# Altium project BME498_Capstone.PrjPcb
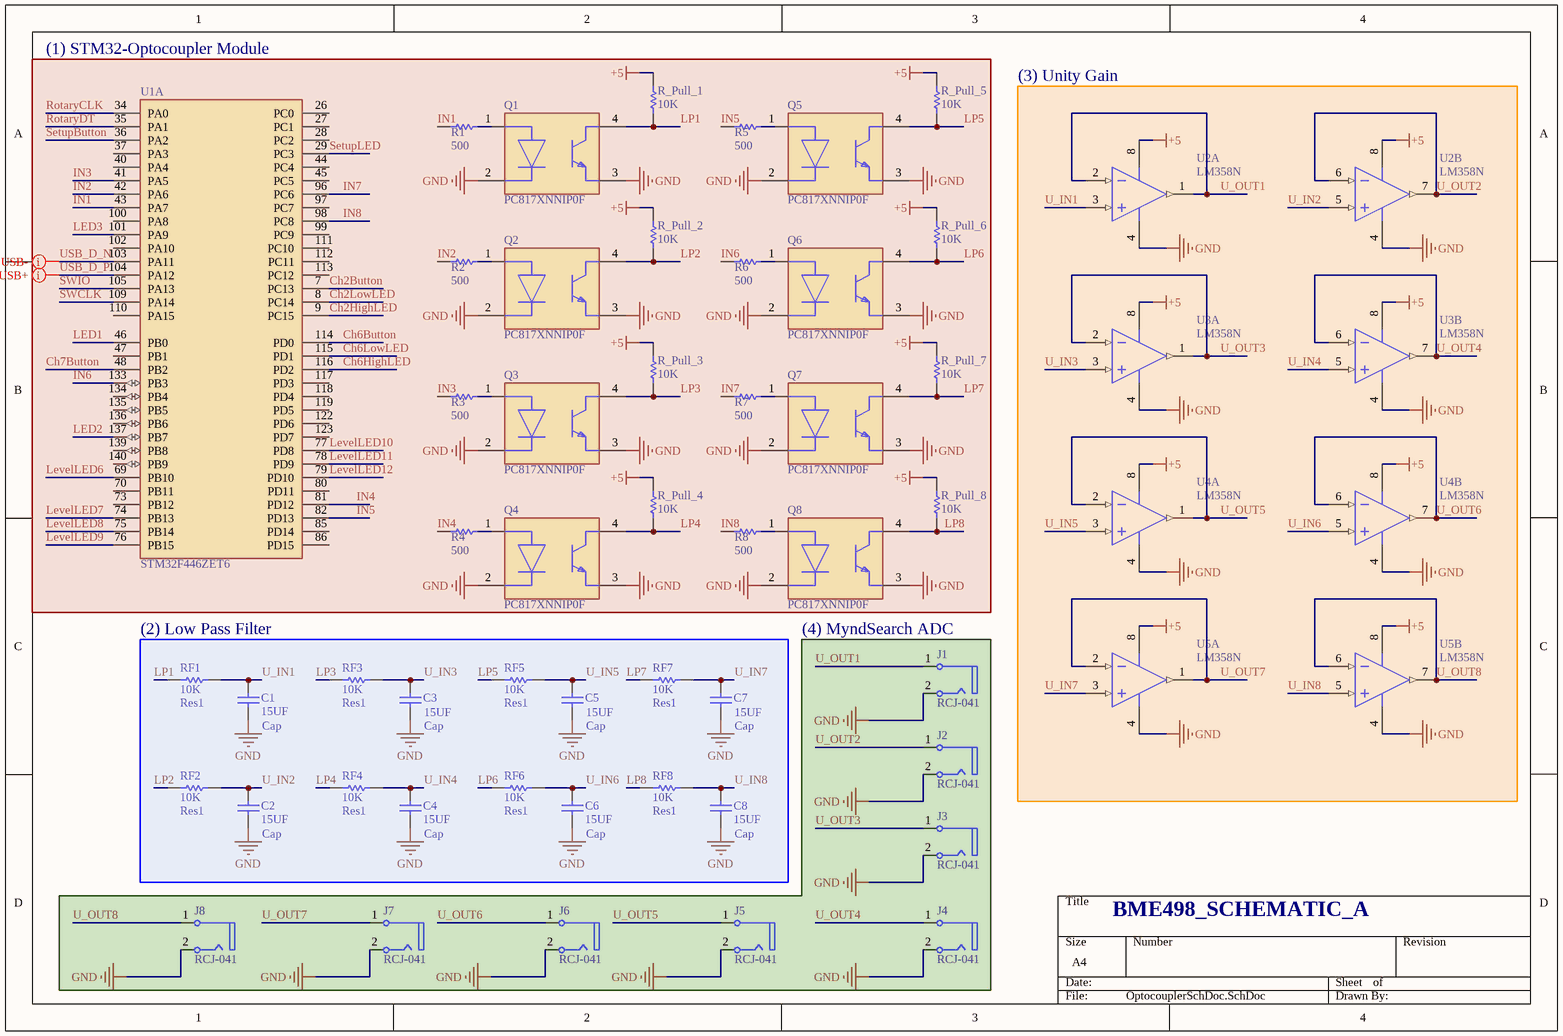
[diagram p0: OptocouplerSchDoc.SchDoc]
2 sheets, 173 parts. Net scope: global (net labels, ports and power ports of the same name join across sheets).
Board file: BME498_PCB.PcbDoc
Sheets:
  OptocouplerSchDoc.SchDoc
  STM32_Peripherals.SchDoc

## Sheet OptocouplerSchDoc.SchDoc
size A4; SheetNumber: 1; SheetTotal: 2

### Parts
C1  Cap  value 15UF  [RADIAL-0.1]
C2  Cap  value 15UF  [RADIAL-0.1]
C3  Cap  value 15UF  [RADIAL-0.1]
C4  Cap  value 15UF  [RADIAL-0.1]
C5  Cap  value 15UF  [RADIAL-0.1]
C6  Cap  value 15UF  [RADIAL-0.1]
C7  Cap  value 15UF  [RADIAL-0.1]
C8  Cap  value 15UF  [RADIAL-0.1]
J1  RCJ-041  [CUI-RCJ-041_V]
J2  RCJ-041  [CUI-RCJ-041_V]
J3  RCJ-041  [CUI-RCJ-041_V]
J4  RCJ-041  [CUI-RCJ-041_V]
J5  RCJ-041  [CUI-RCJ-041_V]
J6  RCJ-041  [CUI-RCJ-041_V]
J7  RCJ-041  [CUI-RCJ-041_V]
J8  RCJ-041  [CUI-RCJ-041_V]
Q1  PC817XNNIP0F  [FP-PC817XNNIP0F-MFG]
Q2  PC817XNNIP0F  [FP-PC817XNNIP0F-MFG]
Q3  PC817XNNIP0F  [FP-PC817XNNIP0F-MFG]
Q4  PC817XNNIP0F  [FP-PC817XNNIP0F-MFG]
Q5  PC817XNNIP0F  [FP-PC817XNNIP0F-MFG]
Q6  PC817XNNIP0F  [FP-PC817XNNIP0F-MFG]
Q7  PC817XNNIP0F  [FP-PC817XNNIP0F-MFG]
Q8  PC817XNNIP0F  [FP-PC817XNNIP0F-MFG]
R1  500  [RESC2013X60X35ML10T20]
R2  500  [RESC2013X60X35ML10T20]
R3  500  [RESC2013X60X35ML10T20]
R4  500  [RESC2013X60X35ML10T20]
R5  500  [RESC2013X60X35ML10T20]
R6  500  [RESC2013X60X35ML10T20]
R7  500  [RESC2013X60X35ML10T20]
R8  500  [RESC2013X60X35ML10T20]
R_Pull_1  10K  [RESC2013X60X35ML10T20]
R_Pull_2  10K  [RESC2013X60X35ML10T20]
R_Pull_3  10K  [RESC2013X60X35ML10T20]
R_Pull_4  10K  [RESC2013X60X35ML10T20]
R_Pull_5  10K  [RESC2013X60X35ML10T20]
R_Pull_6  10K  [RESC2013X60X35ML10T20]
R_Pull_7  10K  [RESC2013X60X35ML10T20]
R_Pull_8  10K  [RESC2013X60X35ML10T20]
RF1  Res1  value 10K  [AXIAL-0.3]
RF2  Res1  value 10K  [AXIAL-0.3]
RF3  Res1  value 10K  [AXIAL-0.3]
RF4  Res1  value 10K  [AXIAL-0.3]
RF5  Res1  value 10K  [AXIAL-0.3]
RF6  Res1  value 10K  [AXIAL-0.3]
RF7  Res1  value 10K  [AXIAL-0.3]
RF8  Res1  value 10K  [AXIAL-0.3]
U1  STM32F446ZET6  [FP-STM32F446ZET6-MFG]  (part A of 3)
U2  LM358N  [ONSC-PDIP-8-626-05_M]  (parts A,B of 2)
U3  LM358N  [ONSC-PDIP-8-626-05_M]  (parts A,B of 2)
U4  LM358N  [ONSC-PDIP-8-626-05_M]  (parts A,B of 2)
U5  LM358N  [ONSC-PDIP-8-626-05_M]  (parts A,B of 2)

### Blocks framed on the sheet
(1) STM32-Optocoupler Module: Q1-Q8 R1-R8 R_Pull_1-R_Pull_8 U1
(3) Unity Gain: U2-U5
(2) Low Pass Filter: C1-C8 RF1-RF8

### Nets
+5: R_Pull_1.2 R_Pull_2.2 R_Pull_3.2 R_Pull_4.2 R_Pull_5.2 R_Pull_6.2 R_Pull_7.2 R_Pull_8.2 U2.8(VCC) U3.8(VCC) U4.8(VCC) U5.8(VCC)
GND: C1.1 C2.1 C3.1 C4.1 C5.1 C6.1 C7.1 C8.1 J1.2 J2.2 J3.2 J4.2 J5.2 J6.2 J7.2 J8.2 Q1.2(C) Q1.3(E) Q2.2(C) Q2.3(E) Q3.2(C) Q3.3(E) Q4.2(C) Q4.3(E) Q5.2(C) Q5.3(E) Q6.2(C) Q6.3(E) Q7.2(C) Q7.3(E) Q8.2(C) Q8.3(E) U2.4(VEE/GND) U3.4(VEE/GND) U4.4(VEE/GND) U5.4(VEE/GND)
Ch2Button: U1.7(PC13)
Ch2HighLED: U1.9(PC15)
Ch2LowLED: U1.8(PC14)
Ch6Button: U1.114(PD0)
Ch6HighLED: U1.116(PD2)
Ch6LowLED: U1.115(PD1)
Ch7Button: U1.48(PB2)
IN1: R1.1 U1.43(PA7)
IN2: R2.1 U1.42(PA6)
IN3: R3.1 U1.41(PA5)
IN4: R4.1 U1.81(PD12)
IN5: R5.1 U1.82(PD13)
IN6: R6.1 U1.133(PB3)
IN7: R7.1 U1.96(PC6)
IN8: R8.1 U1.98(PC8)
LED1: U1.46(PB0)
LED2: U1.137(PB7)
LED3: U1.101(PA9)
LevelLED6: U1.69(PB10)
LevelLED7: U1.74(PB13)
LevelLED8: U1.75(PB14)
LevelLED9: U1.76(PB15)
LevelLED10: U1.77(PD8)
LevelLED11: U1.78(PD9)
LevelLED12: U1.79(PD10)
LP1: Q1.4(C) R_Pull_1.1 RF1.1
LP2: Q2.4(C) R_Pull_2.1 RF2.1
LP3: Q3.4(C) R_Pull_3.1 RF3.1
LP4: Q4.4(C) R_Pull_4.1 RF4.1
LP5: Q5.4(C) R_Pull_5.1 RF5.1
LP6: Q6.4(C) R_Pull_6.1 RF6.1
LP7: Q7.4(C) R_Pull_7.1 RF7.1
LP8: Q8.4(C) R_Pull_8.1 RF8.1
RotaryCLK: U1.34(PA0)
RotaryDT: U1.35(PA1)
SetupButton: U1.36(PA2)
SetupLED: U1.29(PC3)
SWCLK: U1.109(PA14)
SWIO: U1.105(PA13)
U_IN1: C1.2 RF1.2 U2.3(INA+)
U_IN2: C2.2 RF2.2 U2.5(INB+)
U_IN3: C3.2 RF3.2 U3.3(INA+)
U_IN4: C4.2 RF4.2 U3.5(INB+)
U_IN5: C5.2 RF5.2 U4.3(INA+)
U_IN6: C6.2 RF6.2 U4.5(INB+)
U_IN7: C7.2 RF7.2 U5.3(INA+)
U_IN8: C8.2 RF8.2 U5.5(INB+)
U_OUT1: J1.1 U2.1(OUTA) U2.2(INA-)
U_OUT2: J2.1 U2.6(INB-) U2.7(OUTB)
U_OUT3: J3.1 U3.1(OUTA) U3.2(INA-)
U_OUT4: J4.1 U3.6(INB-) U3.7(OUTB)
U_OUT5: J5.1 U4.1(OUTA) U4.2(INA-)
U_OUT6: J6.1 U4.6(INB-) U4.7(OUTB)
U_OUT7: J7.1 U5.1(OUTA) U5.2(INA-)
U_OUT8: J8.1 U5.6(INB-) U5.7(OUTB)
USB_D_N: U1.103(PA11)
USB_D_P: U1.104(PA12)
NetQ1_1: Q1.1(A) R1.2
NetQ2_1: Q2.1(A) R2.2
NetQ3_1: Q3.1(A) R3.2
NetQ4_1: Q4.1(A) R4.2
NetQ5_1: Q5.1(A) R5.2
NetQ6_1: Q6.1(A) R6.2
NetQ7_1: Q7.1(A) R7.2
NetQ8_1: Q8.1(A) R8.2

Not connected (* = marked no-connect by the designer): U1 26(PC0) 27(PC1) 28(PC2) 37(PA3) 40(PA4) 44(PC4) 45(PC5) 47(PB1) 70(PB11) 73(PB12) 80(PD11) 85(PD14) 86(PD15) 97(PC7) 99(PC9) 100(PA8) 102(PA10) 110(PA15) 111(PC10) 112(PC11) 113(PC12) 117(PD3) 118(PD4) 119(PD5) 122(PD6) 123(PD7) 134(PB4) 135(PB5) 136(PB6) 139(PB8) 140(PB9)

### Layout directives
differential pair: USB_D_N, USB_D_P

### Notes on the sheet
- (4) MyndSearch ADC
- BME498_SCHEMATIC_A

### Library data of the parts
C1-C8 = CAP ALUM 15UF 20% 16V RADIAL: Capacitor; Manufacturer Part Number: EEA-GA1C150B; Voltage Rating: 16V; Published: 8-Jun-2000; LatestRevisionDate: 17-Jul-2002; LatestRevisionNote: Re-released for DXP Platform.; Publisher: Altium Limited
J1-J8 = CMP-1692-00002-1: Female RCJ Jack, 2 Position, Height 11.724 mm, Tail Length 4 mm, RoHS, Bulk; Case\Package: Metal; Connector Type: HDMI; Current Rating: 500 mA; Voltage Rating: 40 V; Length: 16.2 mm; Pins: 19; ComponentLink1URL: http://www.cui.com/; ComponentLink1Description: Manufacturer URL; Packaging: Tape and Reel; Lead Pitch: 0.5 mm; PackageDescription: Female RCJ Jack, 2 Position, Height 11.724 mm, Tail Length 4 mm; RoHSCompliant: true; Min Operating Temperature: -55 degC; Height: 6.1 mm; Contact Material: Copper; REACH SVHC: No SVHC; DatasheetVersion: Rev. B, 02/2012; ComponentLink2Description: Datasheet; Contact Plating: Gold; Colour: Black; Max Operating Temperature: 85 degC; Mount: Surface Mount; Package Quantity: 400; Gender: Female; ComponentLink2URL: http://www.cui.com/product/resource/rcj-04x.pdf; PackageReference: RCJ-041
Q1-Q8 = CMP-65434-000005-1: OPTOISOLATOR 5KV TRANS 4SMD; Reverse Breakdown Voltage: 6V; Output Current per Channel: 30mA; Power Dissipation: 200mW; Collector-emitter Voltage-Max: 200mV; Max Output Voltage: 80V; Input Current: 50mA; Forward Voltage: 1.4V; Fall Time: 18000ns; Number of Elements: 1; Input Type: DC; Packaging: Tape and Reel; RoHS Compliant: Yes; Contact Plating: Copper; Min Operating Temperature: -30°C; Collector Emitter Saturation Voltage: 200mV; Max Input Current: 50mA; Radiation Hardening: No; Max Collector Current: 50mA; Case/Package: SMD/SMT; Mount: Surface Mount; Output Voltage: 80V; Forward Current: 50mA; Max Power Dissipation: 200mW; Collector Emitter Voltage (VCEO): 80V; Number of Channels: 1; Rise Time: 18000ns; Isolation Voltage: 5kV; Number of Pins: 4; Lead Free: Lead Free; Package Quantity: 2000; Isolation Voltage-Max: 5kV; Max Operating Temperature: 100°C
R1-R8 = CMP-2100-03671-1: Chip Resistor, 1 KOhm, +/- 1%, 125 mW, -55 to 155 degC, 0805 (2012 Metric), RoHS, Tape and Reel; Manufacturer: Yageo; Temperature Coefficient: 100ppm/degreesC; Voltage Rating (DC): 150V; Max Power Dissipation: 125mW; Resistance: 500Ohm; Number of Pins: 2; Number of Terminations: 2; Datasheet URL: http://www.yageo.com/NewPortal/yageodocoutput?fileName=/pdf/R-Chip/PYu-RC_Group_51_RoHS_L_5.pdf; Length: 0.079inch; Package Description: 2-Pin Surface Mounted Device, Body 2 x 1.25 mm; Depth: 1.25mm; Height: 0.024inch; Military Standard: Not; Case/Package: 0805; Package Reference: 0805; RoHSCompliant: true; Lead Free: LeadFree; Packaging: TapeandReel; Package Quantity: 1; Datasheet Version: Rev. 5, 10/2016; Tolerance: 1%; Min Operating Temperature: -55degC; Voltage Rating: 150V; Composition: ThickFilm; Case Code (Imperial): 0805; Power Rating: 125mW; Width: 0.049inch; Case Code (Metric): 2012; Manufacturer URL: http://www.yageo.com/; Max Operating Temperature: 155degC; REACH SVHC: Unknown; Termination: SMD/SMT
R_Pull_1-R_Pull_8 = CMP-2100-03671-1: Chip Resistor, 1 KOhm, +/- 1%, 125 mW, -55 to 155 degC, 0805 (2012 Metric), RoHS, Tape and Reel; Manufacturer: Yageo; Temperature Coefficient: 100ppm/degreesC; Voltage Rating (DC): 150V; Max Power Dissipation: 125mW; Resistance: 10KOhm; Number of Pins: 2; Number of Terminations: 2; Datasheet URL: http://www.yageo.com/NewPortal/yageodocoutput?fileName=/pdf/R-Chip/PYu-RC_Group_51_RoHS_L_5.pdf; Length: 0.079inch; Package Description: 2-Pin Surface Mounted Device, Body 2 x 1.25 mm; Depth: 1.25mm; Height: 0.024inch; Military Standard: Not; Case/Package: 0805; Package Reference: 0805; RoHSCompliant: true; Lead Free: LeadFree; Packaging: TapeandReel; Package Quantity: 1; Datasheet Version: Rev. 5, 10/2016; Tolerance: 1%; Min Operating Temperature: -55degC; Voltage Rating: 150V; Composition: ThickFilm; Case Code (Imperial): 0805; Power Rating: 125mW; Width: 0.049inch; Case Code (Metric): 2012; Manufacturer URL: http://www.yageo.com/; Max Operating Temperature: 155degC; REACH SVHC: Unknown; Termination: SMD/SMT
RF1-RF8 = RES 10K OHM 5% 1/4W AXIAL: Resistor; Manufacturer Part Number: CFR-25JB-52-10K; Designator: R?; Power Rating: 1/4W; Tolerance: 0.05; Published: 8-Jun-2000; LatestRevisionDate: 17-Jul-2002; LatestRevisionNote: Re-released for DXP Platform.; Publisher: Altium Limited
U1 = CMP-12105-000067-1: IC MCU 32BIT 512KB FLASH 144LQFP; Manufacturer: STMicroelectronics; Standoff Height: 0.05mm; Memory Size: 512KBytes; Data Bus Width: 32bits; Number Of Timers/Counters: 14; Number Of I2C Channels: 4; Number Of Usb Channels: 2; Frequency: 180MHz; Ram Size: 128KBytes; Number Of I/Os: 114; Min Supply Voltage: 1.7V; Max Junction Temp: +105°C; Number Of Cores: 1; Core Architecture: Arm Cortex-M4; Max Supply Voltage: 3.6V; Number Of Adc Channels: 24; Number Of Pwm Channels: 32; Number Of Uart Channels: 6; Number Of A/D Converters: 3; Interface: I2C,SPI,UART,USART,EBI/EMI,CAN,USB,LIN,IrDA,I2S,SMBus,Other; Mouser Description: 32 Bit Microcontroller, High Performance, Arm Cortex-M4, 180 Mhz, 512 Kb, 128 Kb, 144, Lqfp; Temperature Range High: +105°C; Device Class L3: Microcontrollers; Ambient Temperature Range High: +85°C; Lead Free: Yes; Octopart: https://octopart.com/stm32f446zet6-stmicroelectronics-52642927; Device Class L2: Embedded Processors and Controllers; Height: 1.6mm; Category: IC; Manufacturer Part Number: STM32F446ZET6; RoHS: TRUE; Memory Type: FLASH; Temperature: -40°C to +105°C; Number Of Spi Channels: 4; Device Class L1: Integrated Circuits (ICs); Package: LQFP144; Digikey Description: IC MCU 32BIT 512KB FLASH 144LQFP; Automotive: No; ComponentLink2Description: Datasheet; ComponentLink2URL: https://www.st.com/content/ccc/resource/technical/document/datasheet/65/cb/75/50/53/d6/48/24/DM00141306.pdf/files/DM00141306.pdf/jcr:content/translations/en.DM00141306.pdf; Ambient Temperature Range Low: -40°C; Temperature Range Low: -40°C
U2-U5 = CMP-1310-00098-1: Single Supply Dual Operational Amplifier, 3 to 32 V, 0 to 70 degC, 8-Pin PDIP, Tube; Manufacturer: On Semiconductor; VCC Max (V): 32; VCC Min (V): 3; Mounting Technology: Through Hole; ComponentLink3Description: Package Specification; ComponentLink3URL: http://www.onsemi.com/pub_link/Collateral/LM211-D.PDF; RoHS: FALSE; Packing: Tube; PackageDescription: 8-Pin Plastic Dual-In Line Package, Body 9.52 x 6.605 mm, Pitch 2.54 mm; PackageReference: PDIP-8-626-05; PackageVersion: Rev. M, 04/2010; PartNumber: LM358N; ComponentLink2Description: Datasheet; ComponentLink2URL: http://www.onsemi.cn/pub_link/Collateral/LM358-D.PDF; ComponentLink1URL: http://www.onsemi.com/; ComponentLink1Description: Manufacturer URL; DatasheetVersion: Rev. 27

## Sheet STM32_Peripherals.SchDoc
size A3; SheetNumber: 2; SheetTotal: 2
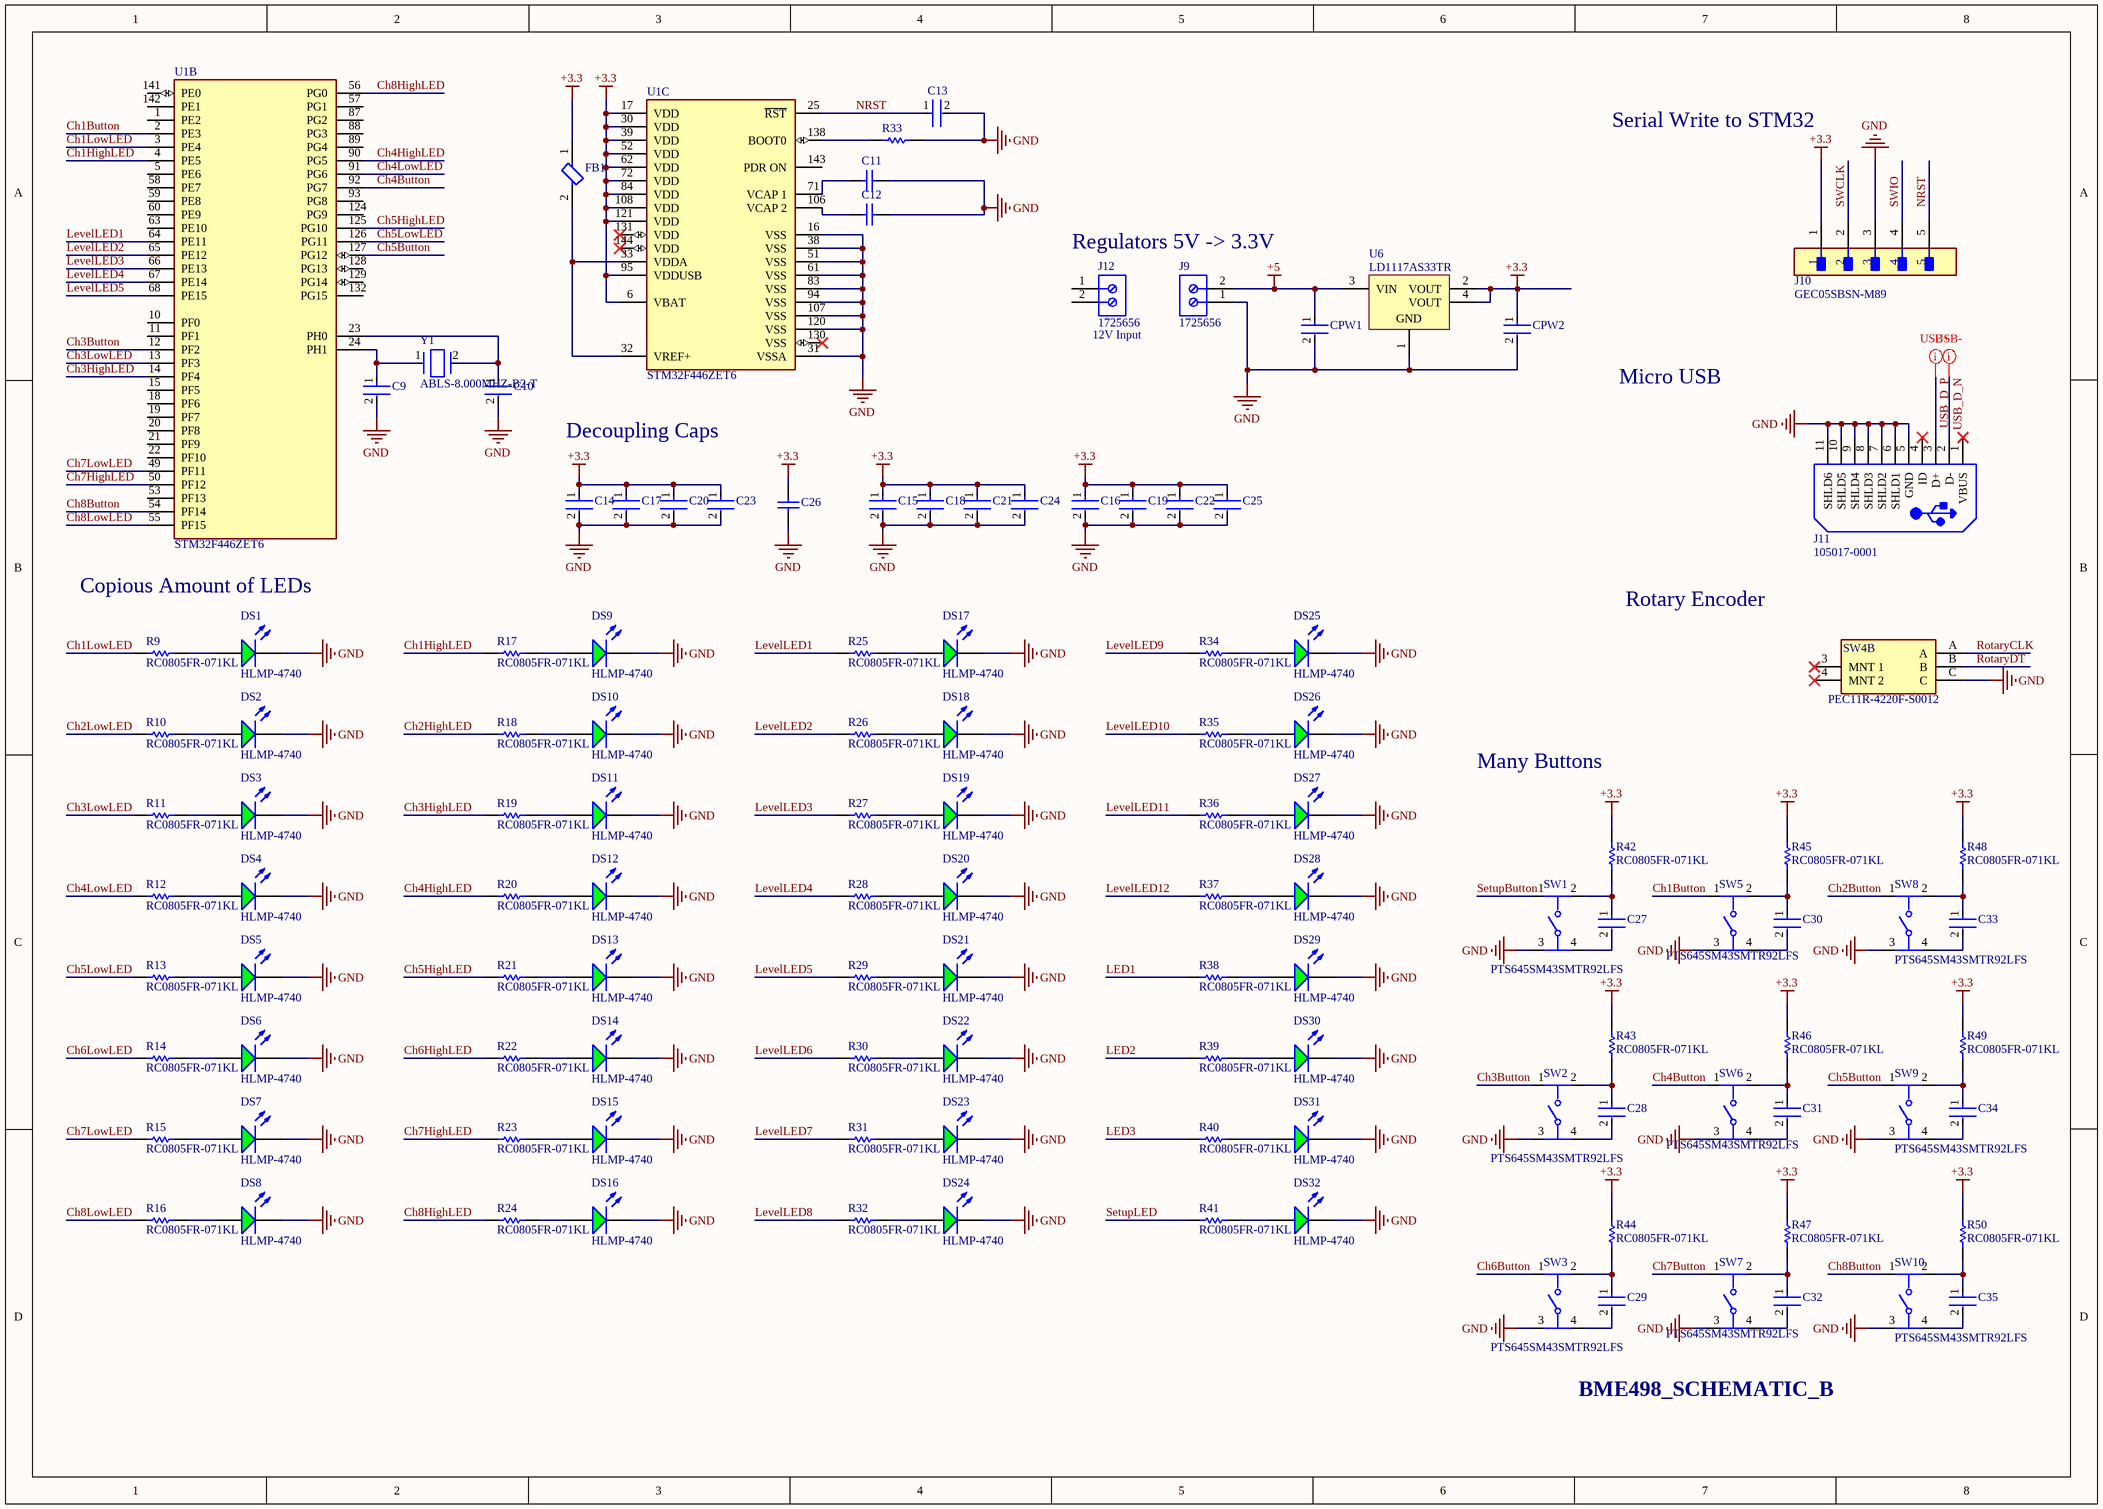
[diagram p1: STM32_Peripherals.SchDoc]

### Parts
C9  C0805C439C5GACTU  [FP-C0805C-DN-MFG]  (value not drawn)
C10  C0805C439C5GACTU  [FP-C0805C-DN-MFG]  (value not drawn)
C11  GRM21BR71C225KA12L  [CAPC2013X135X50ML10T20]  (value not drawn)
C12  GRM21BR71C225KA12L  [CAPC2013X135X50ML10T20]  (value not drawn)
C13  CC0805KRX7R9BB104  [FP-CC0805-0_85-MFG]  (value not drawn)
C14  CC0805KRX7R9BB104  [FP-CC0805-0_85-MFG]  (value not drawn)
C15  CC0805KRX7R9BB104  [FP-CC0805-0_85-MFG]  (value not drawn)
C16  CC0805KRX7R9BB104  [FP-CC0805-0_85-MFG]  (value not drawn)
C17  CC0805KRX7R9BB104  [FP-CC0805-0_85-MFG]  (value not drawn)
C18  CC0805KRX7R9BB104  [FP-CC0805-0_85-MFG]  (value not drawn)
C19  CC0805KRX7R9BB104  [FP-CC0805-0_85-MFG]  (value not drawn)
C20  CC0805KRX7R9BB104  [FP-CC0805-0_85-MFG]  (value not drawn)
C21  CC0805KRX7R9BB104  [FP-CC0805-0_85-MFG]  (value not drawn)
C22  CC0805KRX7R9BB104  [FP-CC0805-0_85-MFG]  (value not drawn)
C23  CC0805KRX7R9BB104  [FP-CC0805-0_85-MFG]  (value not drawn)
C24  CC0805KRX7R9BB104  [FP-CC0805-0_85-MFG]  (value not drawn)
C25  CC0805KRX7R9BB104  [FP-CC0805-0_85-MFG]  (value not drawn)
C26  GRM21BR61C475KA88L  [CAPC2013X135X45LL10T25]  (value not drawn)
C27  CC0805KRX7R9BB104  [FP-CC0805-0_85-MFG]  (value not drawn)
C28  CC0805KRX7R9BB104  [FP-CC0805-0_85-MFG]  (value not drawn)
C29  CC0805KRX7R9BB104  [FP-CC0805-0_85-MFG]  (value not drawn)
C30  CC0805KRX7R9BB104  [FP-CC0805-0_85-MFG]  (value not drawn)
C31  CC0805KRX7R9BB104  [FP-CC0805-0_85-MFG]  (value not drawn)
C32  CC0805KRX7R9BB104  [FP-CC0805-0_85-MFG]  (value not drawn)
C33  CC0805KRX7R9BB104  [FP-CC0805-0_85-MFG]  (value not drawn)
C34  CC0805KRX7R9BB104  [FP-CC0805-0_85-MFG]  (value not drawn)
C35  CC0805KRX7R9BB104  [FP-CC0805-0_85-MFG]  (value not drawn)
CPW1  CC0805KRX7R9BB104  [FP-CC0805-0_85-MFG]  (value not drawn)
CPW2  CC0805KRX7R9BB104  [FP-CC0805-0_85-MFG]  (value not drawn)
DS1  HLMP-4740  [AVAG-HLMP-4740]
DS2  HLMP-4740  [AVAG-HLMP-4740]
DS3  HLMP-4740  [AVAG-HLMP-4740]
DS4  HLMP-4740  [AVAG-HLMP-4740]
DS5  HLMP-4740  [AVAG-HLMP-4740]
DS6  HLMP-4740  [AVAG-HLMP-4740]
DS7  HLMP-4740  [AVAG-HLMP-4740]
DS8  HLMP-4740  [AVAG-HLMP-4740]
DS9  HLMP-4740  [AVAG-HLMP-4740]
DS10  HLMP-4740  [AVAG-HLMP-4740]
DS11  HLMP-4740  [AVAG-HLMP-4740]
DS12  HLMP-4740  [AVAG-HLMP-4740]
DS13  HLMP-4740  [AVAG-HLMP-4740]
DS14  HLMP-4740  [AVAG-HLMP-4740]
DS15  HLMP-4740  [AVAG-HLMP-4740]
DS16  HLMP-4740  [AVAG-HLMP-4740]
DS17  HLMP-4740  [AVAG-HLMP-4740]
DS18  HLMP-4740  [AVAG-HLMP-4740]
DS19  HLMP-4740  [AVAG-HLMP-4740]
DS20  HLMP-4740  [AVAG-HLMP-4740]
DS21  HLMP-4740  [AVAG-HLMP-4740]
DS22  HLMP-4740  [AVAG-HLMP-4740]
DS23  HLMP-4740  [AVAG-HLMP-4740]
DS24  HLMP-4740  [AVAG-HLMP-4740]
DS25  HLMP-4740  [AVAG-HLMP-4740]
DS26  HLMP-4740  [AVAG-HLMP-4740]
DS27  HLMP-4740  [AVAG-HLMP-4740]
DS28  HLMP-4740  [AVAG-HLMP-4740]
DS29  HLMP-4740  [AVAG-HLMP-4740]
DS30  HLMP-4740  [AVAG-HLMP-4740]
DS31  HLMP-4740  [AVAG-HLMP-4740]
DS32  HLMP-4740  [AVAG-HLMP-4740]
FB1  BLM21SP181SN1D  [FP-BLM21-0_2-t0_85-e0_5-IPC_A]  (value not drawn)
J9  1725656  [PHOE-1725656-2]
J10  GEC05SBSN-M89  [FP-GEC05SBSN-M89-MFG]
J11  105017-0001  [USB-MICRO-B_V]
J12  1725656  [PHOE-1725656-2]
R9  RC0805FR-071KL  [RESC2013X60X35ML10T20]
R10  RC0805FR-071KL  [RESC2013X60X35ML10T20]
R11  RC0805FR-071KL  [RESC2013X60X35ML10T20]
R12  RC0805FR-071KL  [RESC2013X60X35ML10T20]
R13  RC0805FR-071KL  [RESC2013X60X35ML10T20]
R14  RC0805FR-071KL  [RESC2013X60X35ML10T20]
R15  RC0805FR-071KL  [RESC2013X60X35ML10T20]
R16  RC0805FR-071KL  [RESC2013X60X35ML10T20]
R17  RC0805FR-071KL  [RESC2013X60X35ML10T20]
R18  RC0805FR-071KL  [RESC2013X60X35ML10T20]
R19  RC0805FR-071KL  [RESC2013X60X35ML10T20]
R20  RC0805FR-071KL  [RESC2013X60X35ML10T20]
R21  RC0805FR-071KL  [RESC2013X60X35ML10T20]
R22  RC0805FR-071KL  [RESC2013X60X35ML10T20]
R23  RC0805FR-071KL  [RESC2013X60X35ML10T20]
R24  RC0805FR-071KL  [RESC2013X60X35ML10T20]
R25  RC0805FR-071KL  [RESC2013X60X35ML10T20]
R26  RC0805FR-071KL  [RESC2013X60X35ML10T20]
R27  RC0805FR-071KL  [RESC2013X60X35ML10T20]
R28  RC0805FR-071KL  [RESC2013X60X35ML10T20]
R29  RC0805FR-071KL  [RESC2013X60X35ML10T20]
R30  RC0805FR-071KL  [RESC2013X60X35ML10T20]
R31  RC0805FR-071KL  [RESC2013X60X35ML10T20]
R32  RC0805FR-071KL  [RESC2013X60X35ML10T20]
R33  RC0805FR-0710KL  [RESC2013X60X35NL10T20]  (value not drawn)
R34  RC0805FR-071KL  [RESC2013X60X35ML10T20]
R35  RC0805FR-071KL  [RESC2013X60X35ML10T20]
R36  RC0805FR-071KL  [RESC2013X60X35ML10T20]
R37  RC0805FR-071KL  [RESC2013X60X35ML10T20]
R38  RC0805FR-071KL  [RESC2013X60X35ML10T20]
R39  RC0805FR-071KL  [RESC2013X60X35ML10T20]
R40  RC0805FR-071KL  [RESC2013X60X35ML10T20]
R41  RC0805FR-071KL  [RESC2013X60X35ML10T20]
R42  RC0805FR-071KL  [RESC2013X60X35ML10T20]
R43  RC0805FR-071KL  [RESC2013X60X35ML10T20]
R44  RC0805FR-071KL  [RESC2013X60X35ML10T20]
R45  RC0805FR-071KL  [RESC2013X60X35ML10T20]
R46  RC0805FR-071KL  [RESC2013X60X35ML10T20]
R47  RC0805FR-071KL  [RESC2013X60X35ML10T20]
R48  RC0805FR-071KL  [RESC2013X60X35ML10T20]
R49  RC0805FR-071KL  [RESC2013X60X35ML10T20]
R50  RC0805FR-071KL  [RESC2013X60X35ML10T20]
SW1  PTS645SM43SMTR92LFS  [FP-PTS645SM43SMTR92LFS-MFG]
SW2  PTS645SM43SMTR92LFS  [FP-PTS645SM43SMTR92LFS-MFG]
SW3  PTS645SM43SMTR92LFS  [FP-PTS645SM43SMTR92LFS-MFG]
SW4  PEC11R-4220F-S0012  [FP-PEC11R-4220F-S0012-MFG]  (part B of 2)
SW5  PTS645SM43SMTR92LFS  [FP-PTS645SM43SMTR92LFS-MFG]
SW6  PTS645SM43SMTR92LFS  [FP-PTS645SM43SMTR92LFS-MFG]
SW7  PTS645SM43SMTR92LFS  [FP-PTS645SM43SMTR92LFS-MFG]
SW8  PTS645SM43SMTR92LFS  [FP-PTS645SM43SMTR92LFS-MFG]
SW9  PTS645SM43SMTR92LFS  [FP-PTS645SM43SMTR92LFS-MFG]
SW10  PTS645SM43SMTR92LFS  [FP-PTS645SM43SMTR92LFS-MFG]
U1  STM32F446ZET6  [FP-STM32F446ZET6-MFG]  (parts B,C of 3)
U6  LD1117AS33TR  [SOT-223_M]
Y1  ABLS-8.000MHZ-B2-T  [FP-ABLS-MFG]

### Nets
+3.3: C14.1 C15.1 C16.1 C17.1 C18.1 C19.1 C20.1 C21.1 C22.1 C23.1 C24.1 C25.1 C26.1 CPW2.1 FB1.1 J10.1 R42.2 R43.2 R44.2 R45.2 R46.2 R47.2 R48.2 R49.2 R50.2 U1.6(VBAT) U1.17(VDD) U1.30(VDD) U1.39(VDD) U1.52(VDD) U1.62(VDD) U1.72(VDD) U1.84(VDD) U1.95(VDDUSB) U1.108(VDD) U1.121(VDD) U6.2(VOUT) U6.4(VOUT)
+5: CPW1.1 J9.2 U6.3(VIN)
GND: C9.2 C10.2 C11.2 C12.2 C13.2 C14.2 C15.2 C16.2 C17.2 C18.2 C19.2 C20.2 C21.2 C22.2 C23.2 C24.2 C25.2 C26.2 CPW1.2 CPW2.2 DS1.2(K) DS2.2(K) DS3.2(K) DS4.2(K) DS5.2(K) DS6.2(K) DS7.2(K) DS8.2(K) DS9.2(K) DS10.2(K) DS11.2(K) DS12.2(K) DS13.2(K) DS14.2(K) DS15.2(K) DS16.2(K) DS17.2(K) DS18.2(K) DS19.2(K) DS20.2(K) DS21.2(K) DS22.2(K) DS23.2(K) DS24.2(K) DS25.2(K) DS26.2(K) DS27.2(K) DS28.2(K) DS29.2(K) DS30.2(K) DS31.2(K) DS32.2(K) J9.1 J10.3 J11.5(GND) J11.6(SHLD1) J11.7(SHLD2) J11.8(SHLD3) J11.9(SHLD4) J11.10(SHLD5) J11.11(SHLD6) R33.2 SW1.3 SW2.3 SW3.3 SW4.C SW5.3 SW6.3 SW7.3 SW8.3 SW9.3 SW10.3 U1.16(VSS) U1.31(VSSA) U1.38(VSS) U1.51(VSS) U1.61(VSS) U1.83(VSS) U1.94(VSS) U1.107(VSS) U1.120(VSS) U6.1(GND)
Ch1Button: SW5.1 U1.2(PE3)
Ch1HighLED: R17.1 U1.4(PE5)
Ch1LowLED: R9.1 U1.3(PE4)
Ch2Button: SW8.1
Ch2HighLED: R18.1
Ch2LowLED: R10.1
Ch3Button: SW2.1 U1.12(PF2)
Ch3HighLED: R19.1 U1.14(PF4)
Ch3LowLED: R11.1 U1.13(PF3)
Ch4Button: SW6.1 U1.92(PG7)
Ch4HighLED: R20.1 U1.90(PG5)
Ch4LowLED: R12.1 U1.91(PG6)
Ch5Button: SW9.1 U1.127(PG12)
Ch5HighLED: R21.1 U1.125(PG10)
Ch5LowLED: R13.1 U1.126(PG11)
Ch6Button: SW3.1
Ch6HighLED: R22.1
Ch6LowLED: R14.1
Ch7Button: SW7.1
Ch7HighLED: R23.1 U1.50(PF12)
Ch7LowLED: R15.1 U1.49(PF11)
Ch8Button: SW10.1 U1.54(PF14)
Ch8HighLED: R24.1 U1.56(PG0)
Ch8LowLED: R16.1 U1.55(PF15)
LED1: R38.1
LED2: R39.1
LED3: R40.1
LevelLED1: R25.1 U1.64(PE11)
LevelLED2: R26.1 U1.65(PE12)
LevelLED3: R27.1 U1.66(PE13)
LevelLED4: R28.1 U1.67(PE14)
LevelLED5: R29.1 U1.68(PE15)
LevelLED6: R30.1
LevelLED7: R31.1
LevelLED8: R32.1
LevelLED9: R34.1
LevelLED10: R35.1
LevelLED11: R36.1
LevelLED12: R37.1
NRST: C13.1 J10.5 U1.25(~{RST})
RotaryCLK: SW4.A
RotaryDT: SW4.B
SetupButton: SW1.1
SetupLED: R41.1
SWCLK: J10.2
SWIO: J10.4
USB_D_N: J11.2(D-)
USB_D_P: J11.3(D+)
NetC9_1: C9.1 U1.24(PH1) Y1.1
NetC10_1: C10.1 U1.23(PH0) Y1.2
NetC11_1: C11.1 U1.71(VCAP_1)
NetC12_1: C12.1 U1.106(VCAP_2)
NetC27_1: C27.1 R42.1 SW1.2
NetC27_2: C27.2 SW1.4
NetC28_1: C28.1 R43.1 SW2.2
NetC28_2: C28.2 SW2.4
NetC29_1: C29.1 R44.1 SW3.2
NetC29_2: C29.2 SW3.4
NetC30_1: C30.1 R45.1 SW5.2
NetC30_2: C30.2 SW5.4
NetC31_1: C31.1 R46.1 SW6.2
NetC31_2: C31.2 SW6.4
NetC32_1: C32.1 R47.1 SW7.2
NetC32_2: C32.2 SW7.4
NetC33_1: C33.1 R48.1 SW8.2
NetC33_2: C33.2 SW8.4
NetC34_1: C34.1 R49.1 SW9.2
NetC34_2: C34.2 SW9.4
NetC35_1: C35.1 R50.1 SW10.2
NetC35_2: C35.2 SW10.4
NetDS1_1: DS1.1(A) R9.2
NetDS2_1: DS2.1(A) R10.2
NetDS3_1: DS3.1(A) R11.2
NetDS4_1: DS4.1(A) R12.2
NetDS5_1: DS5.1(A) R13.2
NetDS6_1: DS6.1(A) R14.2
NetDS7_1: DS7.1(A) R15.2
NetDS8_1: DS8.1(A) R16.2
NetDS9_1: DS9.1(A) R17.2
NetDS10_1: DS10.1(A) R18.2
NetDS11_1: DS11.1(A) R19.2
NetDS12_1: DS12.1(A) R20.2
NetDS13_1: DS13.1(A) R21.2
NetDS14_1: DS14.1(A) R22.2
NetDS15_1: DS15.1(A) R23.2
NetDS16_1: DS16.1(A) R24.2
NetDS17_1: DS17.1(A) R25.2
NetDS18_1: DS18.1(A) R26.2
NetDS19_1: DS19.1(A) R27.2
NetDS20_1: DS20.1(A) R28.2
NetDS21_1: DS21.1(A) R29.2
NetDS22_1: DS22.1(A) R30.2
NetDS23_1: DS23.1(A) R31.2
NetDS24_1: DS24.1(A) R32.2
NetDS25_1: DS25.1(A) R34.2
NetDS26_1: DS26.1(A) R35.2
NetDS27_1: DS27.1(A) R36.2
NetDS28_1: DS28.1(A) R37.2
NetDS29_1: DS29.1(A) R38.2
NetDS30_1: DS30.1(A) R39.2
NetDS31_1: DS31.1(A) R40.2
NetDS32_1: DS32.1(A) R41.2
NetFB1_2: FB1.2 U1.32(VREF+) U1.33(VDDA)
NetR33_1: R33.1 U1.138(BOOT0)

Not connected (* = marked no-connect by the designer): J11 1(VBUS)* 4(ID)*; J12 1 2; SW4 3(MNT_1)* 4(MNT_2)*; U1 1(PE2) 5(PE6) 10(PF0) 11(PF1) 15(PF5) 18(PF6) 19(PF7) 20(PF8) 21(PF9) 22(PF10) 53(PF13) 57(PG1) 58(PE7) 59(PE8) 60(PE9) 63(PE10) 87(PG2) 88(PG3) 89(PG4) 93(PG8) 124(PG9) 128(PG13) 129(PG14) 130(VSS)* 131(VDD)* 132(PG15) 141(PE0) 142(PE1) 143(PDR_ON) 144(VDD)*

### Layout directives
differential pair: USB_D_N, USB_D_P

### Notes on the sheet
- Serial Write to STM32
- Regulators 5V -> 3.3V
- (near J12) 12V Input
- Decoupling Caps
- Micro USB
- Copious Amount of LEDs
- Rotary Encoder
- Many Buttons
- BME498_SCHEMATIC_B

### Library data of the parts
C9 C10 = CMP-03020-016664-1: CAP CER 4.3PF 50V NP0 0805; Manufacturer: KEMET; Tolerance: 0.25 pF; Temperature Characteristic: C0G; Temperature Coefficient: 30ppm/°C; Material: Ceramic; Octopart: https://octopart.com/c0805c439c5gactu-kemet-9144293; Capacitance: 4.3 pF; Automotive: No; Height: 0.88mm; Device Class L1: Passive Components; ComponentLink2URL: https://content.kemet.com/datasheets/KEM_C1003_C0G_SMD.pdf; RoHS: TRUE; Temperature Range Low: -55°C; Temperature Range High: +125°C; Mouser Description: Multilayer Ceramic Capacitors MLCC - SMD/SMT 50volts 4.3pF C0G 0.25%; Digikey Description: CAP CER 4.3PF 50V NP0 0805; Temperature: -55°C to +125°C; Ipc Land Pattern Name: CAPC200125X78; Value: 4.3 pF; Device Class L2: Capacitors; Device Class L3: Ceramic Capacitors; Package: C0805C-DN; Voltage Rating: 50 V; ComponentLink2Description: Datasheet; Lead Free: Yes; Category: Cap; Manufacturer Part Number: C0805C439C5GACTU
C11 C12 = CMP-2007-03455-1: Manufacturer: Murata; Part Number: GRM21BR71C225KA12L
C13-C25 C27-C35 = CMP-2100-03606-3: CAP CER 0.1UF 50V X7R 0805; Manufacturer: Yageo; Tolerance: 0.1; Capacitance: 100 nF; Value: 100 nF; Material: Ceramic; Device Class L1: Passive Components; ComponentLink2Description: Datasheet; Package: CC0805-0.85; Manufacturer Part Number: CC0805KRX7R9BB104; Digikey Description: CAP CER 0.1UF 50V X7R 0805; Device Class L3: Ceramic Capacitors; Temperature: -30°C to +85°C; Temperature Characteristic: X7R; Voltage Rating: 50 V; Height: 0.95mm; RoHS: TRUE; Ipc Land Pattern Name: CAPC200125X85; Device Class L2: Capacitors; Category: Cap; Temperature Range Low: -30°C; Temperature Range High: +85°C; Mouser Description: Multilayer Ceramic Capacitors MLCC - SMD/SMT 100nF 50V X7R 10%; Footprint Url: http://www.yageo.com/exep/pages/download/literatures/UPY-C_GEN_24.pdf; Automotive: No; Octopart: https://octopart.com/cc0805krx7r9bb104-yageo-192993; Lead Free: Yes; ComponentLink2URL: http://www.yageo.com/documents/recent/UPY-GPHC_Y5V_6.3V-to-50V_8.pdf
C26 = CMP-1662-00015-2: Chip Capacitor, 4.7 uF, +/- 10%, 16 V, -55 to 85 degC, 0805 (2012 Metric), RoHS, Tape and Reel; Voltage Rating (DC): 16 V; Capacitance: 4.7 uF; Type (Capacitors): X5R; Case\/Package: 0805; Pins: 2; DatasheetVersion: 03/2016; REACH SVHC: No SVHC; Tolerance: 10%; PartNumber: GRM21BR61C475KA88L; Width: 1.25 mm; Mount: Surface Mount; ComponentLink1Description: Manufacturer URL; Case Code (Metric): 2012; PackageDescription: 2-Pin Surface Mount Device, Body 2 x 1.25 mm; Height: 1.25 mm; Voltage Rating: 16 V; Max Operating Temperature: 85 degC; RoHSCompliant: true; Length: 2 mm; ComponentLink1URL: http://www.murata.com/; Mounting Technology: Surface Mount; Packaging: Tape and Reel; Min Operating Temperature: -55 degC; ComponentLink2Description: Datasheet; Case Code (Imperial): 0805; Radiation Hardening: No; Package Quantity: 3000; PackageReference: 0805; ComponentLink2URL: http://search.murata.co.jp/Ceramy/image/img/A01X/G101/ENG/GRM21BR61C475KA88-01.pdf
CPW1 CPW2 = CMP-2100-03606-3: CAP CER 0.1UF 50V X7R 0805; Manufacturer: Yageo; Tolerance: 0.1; Capacitance: 100 nF; Value: 100 nF; Device Class L1: Passive Components; ComponentLink2Description: Datasheet; Package: CC0805-0.85; Manufacturer Part Number: CC0805KRX7R9BB104; Digikey Description: CAP CER 0.1UF 50V X7R 0805; Device Class L3: Ceramic Capacitors; Temperature: -30°C to +85°C; Temperature Characteristic: X7R; Voltage Rating: 50 V; Height: 0.95mm; RoHS: TRUE; Ipc Land Pattern Name: CAPC200125X85; Device Class L2: Capacitors; Category: Cap; Temperature Range Low: -30°C; Temperature Range High: +85°C; Material: Ceramic; Mouser Description: Multilayer Ceramic Capacitors MLCC - SMD/SMT 100nF 50V X7R 10%; Footprint Url: http://www.yageo.com/exep/pages/download/literatures/UPY-C_GEN_24.pdf; Automotive: No; Octopart: https://octopart.com/cc0805krx7r9bb104-yageo-192993; Lead Free: Yes; ComponentLink2URL: http://www.yageo.com/documents/recent/UPY-GPHC_Y5V_6.3V-to-50V_8.pdf
DS1-DS32 = CMP-2000-06413-1: T-1 3/4 (5 mm) Low Current LED Lamp, Green, 1.9 V, -20 to 100 degC, 2-Pin THD, RoHS, Bulk; Manufacturer: AvagoTechnologies; Type: Uni-Color; Peak Wavelength: 565nm; Rad Hard: No; Viewing Angle: 50°; Dominant Wavelength/Color Temperature: 569nm; Number of LEDs: 1; Lens Appearance: ColoredDiffused; Lens Shape Type: Circular; Mounting Orientation: TopMount; Intensity: 2.3mcd; Datasheet Version: 07/2014; Category: LEDs; Datasheet URL: http://docs.avagotech.com/docs/AV02-1557EN; Packaging: Bulk; Pin Count: 2; Mounting Technology: ThroughHole; Package Reference: HLMP-4740; Mounting: ThroughHole; Manufacturer URL: http://www.avagotech.com/; Color: Green; Package: 2T-13/4; Package Description: 2-Pin Through Hole Device, Dia 5.845 mm, Pitch 2.54 mm
FB1 = CMP-06046-001899-2: Chip Ferrite Bead, 0805, 180Ω @ 100MHz, 0.02Ω, 25%, 4A; RoHS Compliant: Yes
J9 J12 = CMP-2000-05299-1: Male Header, Pitch 2.54 mm, 1 x 2 Position, Height 9 mm, Tail Length 3.5 mm; Manufacturer: Phoenix Contact; Number of contacts: 2; Content: 250pc(s); Pitch: 2.54mm; Industrial packaging: Yes; Colour: Green; Manufacturer part No.: 1725656; Type: MPT0,5/2-2,54; Datasheet URL: http://datasheet.octopart.com/1725656-Phoenix-Contact-datasheet-5302866.pdf; Manufacturer URL: http://www.phoenixcontact.com/; Datasheet Version: Apr-08
J10 = CMP-25680-000065-1: CONN HEADER SMD R/A 5POS 2.54MM; Gender: Male; Connector Type: Male Pin; Pitch: 0.1inch; Number of Positions: 5; Package Quantity: 1; Contact Type: Male Pin; Number of Rows: 1; Housing Material: Plastic; Series: -; Housing Color: Black; Termination: Solder; Lead Free: Lead Free; Number of Contacts: 5; Width: 2.54mm; Mount: Surface Mount; Length: 12.7mm; Color: Black; RoHS Compliant: Yes; Height: 3.56mm; Packaging: Bulk; Contact Mating Length: 0.23inch; Contact Plating: Tin; Contact Material: Bronze
J11 = CMP-2000-05827-1: Micro-USB B Receptacle, Right Angle, Bottom Mount, Surface Mount, with Solder Tabs, -30 to 85 degC, 5-Pin USB, RoHS, Tape and Reel; Manufacturer: Molex; Featured Product: Micro-USBConnectorsUSBConnectors; Other Names: WM1399DKR; Package Version: Rev. F, 12/2012; Number of Contacts: 5; Connector Type: USB-microB; Catalog Drawings: 1050170001; 3D Model: 105017-0001.stp; Mating Products: WM17145-ND-CABLEMICROUSBBTOSTDA1.0MWM17147-ND-CABLEMICROUSBBTOSTDA2.0MWM17146-ND-CABLEMICROUSBBTOSTDA1.5M; PCN Assembly/Origin: ResinSupplier21/Oct/2015; Voltage - Max: 30V; Online Catalog: Molex-MicroUSB; Manufacturer URL: http://www.molex.com/; Package Description: 5-Leads USB, Micro B, Body 7.5 x 5 mm, Pitch 0.65 mm; Datasheet URL: http://www.molex.com/elqNow/elqRedir.htm?ref=http://www.molex.com/webdocs/datasheets/pdf/en-us/1050170001_IO_CONNECTORS.pdf; Ingress Protection: -; Datasheet Version: 03/2016; Mounting Type: BoardCutout,SurfaceMount,RightAngle; Circuits: 5; Standard Package: 1; Package Reference: MICRO-B; Package URL: http://www.molex.com/pdm_docs/sd/1050170001_sd.pdf; Category: Connectors,Interconnects; Series: -; RoHS Information: 1050170001CertofCompliance; Features: Shielded,SolderRetention; Family: USB,DVI,HDMIConnectors; Specifications: -; Gender: Receptacle; Packaging: Digi-Reel®; Mounting Technology: SurfaceMount
R9-R32 R34-R50 = CMP-2100-03671-1: Chip Resistor, 1 KOhm, +/- 1%, 125 mW, -55 to 155 degC, 0805 (2012 Metric), RoHS, Tape and Reel; Manufacturer: Yageo; Temperature Coefficient: 100ppm/degreesC; Voltage Rating (DC): 150V; Max Power Dissipation: 125mW; Resistance: 1KOhm; Number of Pins: 2; Number of Terminations: 2; Datasheet URL: http://www.yageo.com/NewPortal/yageodocoutput?fileName=/pdf/R-Chip/PYu-RC_Group_51_RoHS_L_5.pdf; Length: 0.079inch; Package Description: 2-Pin Surface Mounted Device, Body 2 x 1.25 mm; Depth: 1.25mm; Height: 0.024inch; Military Standard: Not; Case/Package: 0805; Package Reference: 0805; RoHSCompliant: true; Lead Free: LeadFree; Packaging: TapeandReel; Package Quantity: 1; Datasheet Version: Rev. 5, 10/2016; Tolerance: 1%; Min Operating Temperature: -55degC; Voltage Rating: 150V; Composition: ThickFilm; Case Code (Imperial): 0805; Power Rating: 125mW; Width: 0.049inch; Case Code (Metric): 2012; Manufacturer URL: http://www.yageo.com/; Max Operating Temperature: 155degC; REACH SVHC: Unknown; Termination: SMD/SMT
R33 = CMP-1659-00013-4: Chip Resistor, 10 KOhm, +/- 1%, 0.125 W, -55 to 155 degC, 0805 (2012 Metric), RoHS, Tape and Reel; Manufacturer: Yageo; Voltage Rating: 150 V; Mount: Surface Mount; ComponentLink1Description: Manufacturer URL; ComponentLink2URL: http://www.yageo.com/documents/recent/PYu-RC_Group_51_RoHS_L_04.pdf; Pins: 2; Length: 2 mm; Min Operating Temperature: -55 degC; Height: 0.5 mm; Mounting Technology: Surface Mount; RoHSCompliant: true; REACH SVHC: No SVHC; ComponentLink1URL: http://www.yageo.com/; Max Operating Temperature: 155 degC; PackageReference: 0805; DatasheetVersion: Rev. 4, 02/2016; Package Quantity: 5000; Packaging: Tape and Reel; ComponentLink2Description: Datasheet; PackageDescription: 2-Pin Surface Mounted Device, Body 2 x 1.25 mm
SW1-SW3 SW5-SW10 = CMP-2000-05160-2: SWITCH TACTILE SPST-NO 0.05A 12V; Contact Resistance: 100mR; Throw Configuration: SPST; Illumination Type: Non-Illuminated; Mechanical Life: 100000Cycles; Current Rating: 50mA; Switch Function: Off-Mom; Actuator Length: 0.85mm; Actuator Material: Nylon; Actuator Type: Standard; Operating Force: 160gf; Min Operating Temperature: -20°C; REACH SVHC: No SVHC; Termination: Gull Wing; Case/Package: SMD/SMT; Packaging: Tape and Reel; Mount: Surface Mount; Voltage Rating (DC): 12V; Orientation: Straight; Lead Free: Lead Free; Contact Material: Silver; Color: Black; Max Current Rating: 50mA; Contact Plating: Silver; Depth: 9mm; Package Quantity: 1; Max Voltage Rating (DC): 12V; Length: 6mm; Max Operating Temperature: 60°C
SW4 = CMP-07421-000036-1: ROTARY ENCODER MECHANICAL 12PPR; Built in Switch: Yes; Number of Channels: 2; Output Type: Quadrature; Hole Diameter: 7mm; Pulses per Revolution: 12; Termination: PC Pin; Package Quantity: 150; RoHS Compliant: Yes; Mount: Through Hole; Width: 12.5mm; Radiation Hardening: No; Number of Pins: 5; REACH SVHC: No SVHC; Type: Mechanical; Packaging: Bulk; Min Operating Temperature: -30°C; Encoder Type: Mechanical; Height: 13.4mm; Length: 26.5mm; Orientation: Vertical; Max Operating Temperature: 70°C; Series: PEC11R; Detent: Yes
U1 = CMP-12105-000067-1: as U1 on sheet OptocouplerSchDoc; Mouser Description: 32 Bit Microcontroller, High Performance, Arm Cortex-M4, 180 Mhz, 512 Kb, 128 Kb, 144, Lqfp; Temperature Range High: +105°C; Device Class L3: Microcontrollers; Ambient Temperature Range High: +85°C; Lead Free: Yes; Octopart: https://octopart.com/stm32f446zet6-stmicroelectronics-52642927; Device Class L2: Embedded Processors and Controllers; Height: 1.6mm; Category: IC; Manufacturer Part Number: STM32F446ZET6; RoHS: TRUE; Memory Type: FLASH; Temperature: -40°C to +105°C; Number Of Spi Channels: 4; Device Class L1: Integrated Circuits (ICs); Package: LQFP144; Digikey Description: IC MCU 32BIT 512KB FLASH 144LQFP; Automotive: No; ComponentLink2Description: Datasheet; ComponentLink2URL: https://www.st.com/content/ccc/resource/technical/document/datasheet/65/cb/75/50/53/d6/48/24/DM00141306.pdf/files/DM00141306.pdf/jcr:content/translations/en.DM00141306.pdf; Ambient Temperature Range Low: -40°C; Temperature Range Low: -40°C
U6 = CMP-0244-00316-1: 1A, Low Drop Positive Voltage Regulator, 3.3V, 4-Pin SOT-223, Tape and Reel; ComponentLink1Description: Manufacturer URL; DatasheetVersion: 2/12/2011; PackageVersion: 2010; ComponentLink1URL: http://www.st.com; ComponentLink2Description: Datasheet; ComponentLink2URL: http://www.st.com/internet/com/TECHNICAL_RESOURCES/TECHNICAL_LITERATURE/DATASHEET/CD00002116.pdf; PackageDescription: 4-Pin SOT-223 Package, 6.5 x 3.5 mm Body, 2.3 mm Pitch, 7 mm Lead Span; PackageReference: SOT-223
Y1 = CMP-27762-009874-1: CRYSTAL 8.0000MHZ 18PF SMD; ESR (Equivalent Series Resistance): 80R; Operating Frequency: 8 MHz; Frequency Stability: 50ppm; Tolerance: 20ppm; Frequency: 8MHz; Min Operating Temperature: -20°C; Lead Free: Lead Free; Width: 4.7mm; Packaging: Tape and Reel; Series: ABLS; Accuracy: 20ppm; Length: 11.4mm; Frequency Tolerance: 20ppm; Termination: SMD/SMT; Number of Pins: 2; Radiation Hardening: No; Depth: 4.7mm; REACH SVHC: No SVHC; Contact Plating: Tin; Load Capacitance: 18pF; Case/Package: SMD/SMT; Mount: Surface Mount; Package Quantity: 1000; Max Operating Temperature: 70°C; Height: 0.165inch; Series Resistance: 80R

## Nets that join several sheets
+5: OptocouplerSchDoc (12 pins), STM32_Peripherals (CPW1.1 J9.2 U6.3)
GND: OptocouplerSchDoc (36 pins), STM32_Peripherals (82 pins)
Ch2Button: OptocouplerSchDoc (U1.7), STM32_Peripherals (SW8.1)
Ch2HighLED: OptocouplerSchDoc (U1.9), STM32_Peripherals (R18.1)
Ch2LowLED: OptocouplerSchDoc (U1.8), STM32_Peripherals (R10.1)
Ch6Button: OptocouplerSchDoc (U1.114), STM32_Peripherals (SW3.1)
Ch6HighLED: OptocouplerSchDoc (U1.116), STM32_Peripherals (R22.1)
Ch6LowLED: OptocouplerSchDoc (U1.115), STM32_Peripherals (R14.1)
Ch7Button: OptocouplerSchDoc (U1.48), STM32_Peripherals (SW7.1)
LED1: OptocouplerSchDoc (U1.46), STM32_Peripherals (R38.1)
LED2: OptocouplerSchDoc (U1.137), STM32_Peripherals (R39.1)
LED3: OptocouplerSchDoc (U1.101), STM32_Peripherals (R40.1)
LevelLED6: OptocouplerSchDoc (U1.69), STM32_Peripherals (R30.1)
LevelLED7: OptocouplerSchDoc (U1.74), STM32_Peripherals (R31.1)
LevelLED8: OptocouplerSchDoc (U1.75), STM32_Peripherals (R32.1)
LevelLED9: OptocouplerSchDoc (U1.76), STM32_Peripherals (R34.1)
LevelLED10: OptocouplerSchDoc (U1.77), STM32_Peripherals (R35.1)
LevelLED11: OptocouplerSchDoc (U1.78), STM32_Peripherals (R36.1)
LevelLED12: OptocouplerSchDoc (U1.79), STM32_Peripherals (R37.1)
RotaryCLK: OptocouplerSchDoc (U1.34), STM32_Peripherals (SW4.A)
RotaryDT: OptocouplerSchDoc (U1.35), STM32_Peripherals (SW4.B)
SetupButton: OptocouplerSchDoc (U1.36), STM32_Peripherals (SW1.1)
SetupLED: OptocouplerSchDoc (U1.29), STM32_Peripherals (R41.1)
SWCLK: OptocouplerSchDoc (U1.109), STM32_Peripherals (J10.2)
SWIO: OptocouplerSchDoc (U1.105), STM32_Peripherals (J10.4)
USB_D_N: OptocouplerSchDoc (U1.103), STM32_Peripherals (J11.2)
USB_D_P: OptocouplerSchDoc (U1.104), STM32_Peripherals (J11.3)